# EAGLE design 1605_lora_ES920A (EAGLE 9.5.1)
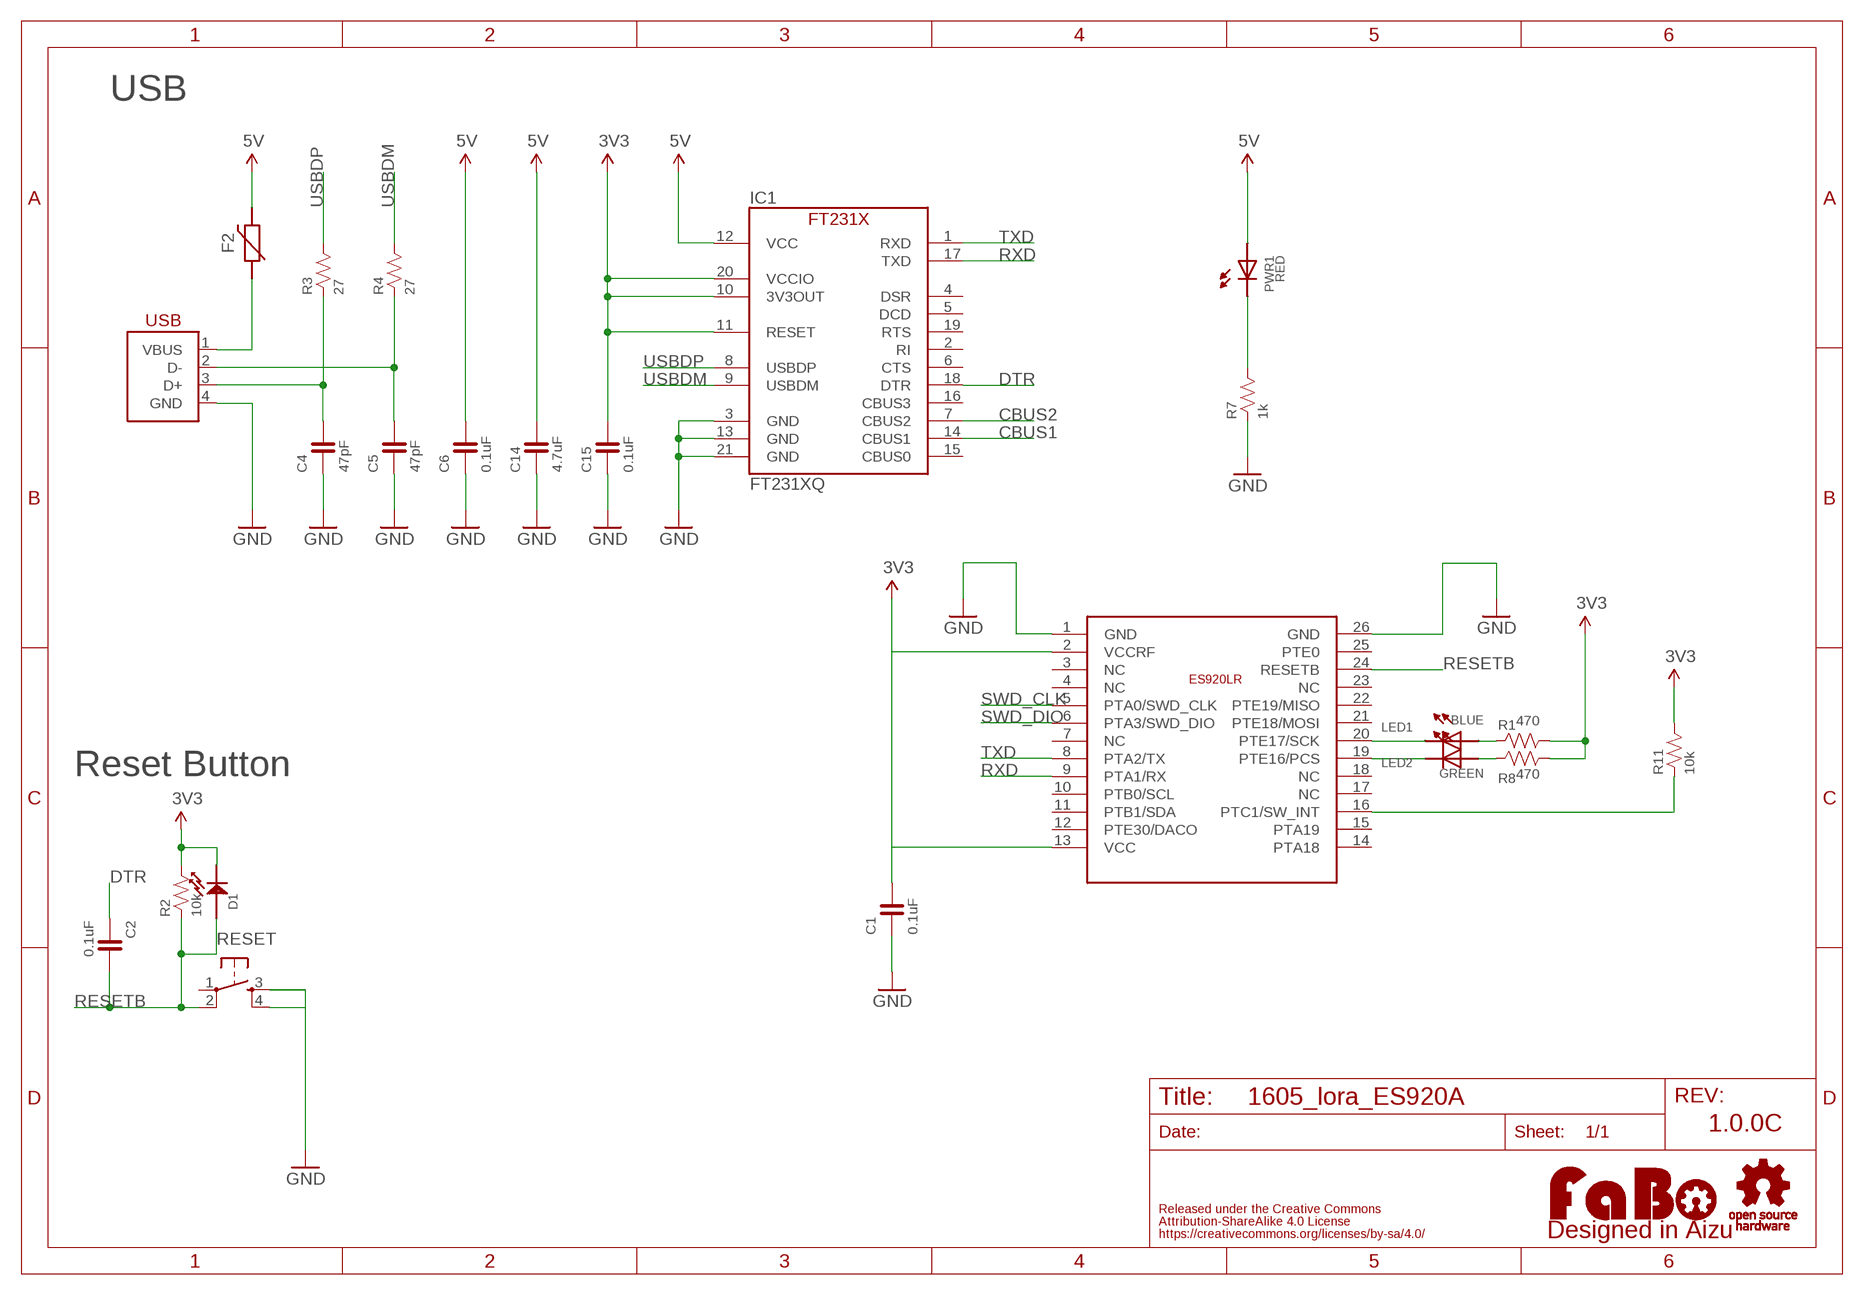
[diagram p0: schematic, sheet 1]

## Parts
C1  0.1uF  CAPACITOR-0603_NARROW  [0603-NARROW]
C2  0.1uF  CAPACITOR-0603_NARROW  [0603-NARROW]
C4  47pF  CAPACITOR-0603_NARROW  [0603-NARROW]
C5  47pF  CAPACITOR-0603_NARROW  [0603-NARROW]
C6  0.1uF  CAPACITOR-0603_NARROW  [0603-NARROW]
C14  4.7uF  CAPACITOR-0603_NARROW  [0603-NARROW]
C15  0.1uF  CAPACITOR-0603_NARROW  [0603-NARROW]
D1  DIODE0603  [0603]
F2  POLYSWITCH  [NANOSMDC035F]
IC1  FT231XQ  [QFN-20_FT231X]
LED1  BLUE  LED-0603  [0603]
LED2  GREEN  LED-0603  [0603]
PWR1  RED  LED-0603-NARROW  [0603-NARROW]
R1  470  RESISTOR-0603-NARROW  [0603-NARROW]
R2  10k  RESISTOR-0603-NARROW  [0603-NARROW]
R3  27  RESISTOR-0603-NARROW  [0603-NARROW]
R4  27  RESISTOR-0603-NARROW  [0603-NARROW]
R7  1k  RESISTOR-0603-NARROW  [0603-NARROW]
R8  470  RESISTOR-0603-NARROW  [0603-NARROW]
R11  10k  RESISTOR-0603-NARROW  [0603-NARROW]
RESET  TACT-SWITCH-SMD_KMR2  [KMR2]
U2  ES920LR_MODULE  [MODULE]
U$2  LOGO_OSHW-M_BOTTOM  [LOGO_OSHW_M_BOTTOM]
U$5  LOGO_FABO-M  [LOGO_FABO_MS]
USB1  USB-B_PTH  [USB-4AF103BS]

## Nets
3V3: C1.2 C15.2 D1.CATHODE IC1.10(3V3OUT) IC1.11(RESET) IC1.20(VCCIO) R1.2 R2.2 R8.2 R11.2 U2.2(VCCRF) U2.13(VCC)
5V: C6.2 C14.2 F2.2 IC1.12(VCC) PWR1.ANODE
CBUS1: IC1.14(CBUS1)
CBUS2: IC1.7(CBUS2)
DTR: C2.1 IC1.18(DTR)
GND: C1.1 C4.1 C5.1 C6.1 C14.1 C15.1 IC1.3(GND) IC1.13(GND) IC1.21(GND) R7.1 RESET.3 RESET.4 U2.1(GND) USB1.4(GND)
N$2: U2.26(GND) ; supply symbol labelled GND
N$3: LED2.CATHODE U2.19(PTE16/PCS)
N$4: LED1.CATHODE U2.20(PTE17/SCK)
N$5: LED1.ANODE R1.1
N$6: LED2.ANODE R8.1
N$7: C5.2 R4.1 USB1.2(D-)
N$8: C4.2 R3.1 USB1.3(D+)
N$11: PWR1.CATHODE R7.2
N$12: R11.1 U2.16(PTC1/SW_INT)
RESETB: C2.2 D1.ANODE R2.1 RESET.2 U2.24(RESETB)
RXD: IC1.17(TXD) U2.9(PTA1/RX)
SWD_CLK: U2.5(PTA0/SWD_CLK)
SWD_DIO: U2.6(PTA3/SWD_DIO)
TXD: IC1.1(RXD) U2.8(PTA2/TX)
USBDM: IC1.9(USBDM) R4.2
USBDP: IC1.8(USBDP) R3.2
VBUS1: F2.1 USB1.1(VBUS)
Unconnected: IC1.2(RI) IC1.4(DSR) IC1.5(DCD) IC1.6(CTS) IC1.15(CBUS0) IC1.16(CBUS3) IC1.19(RTS) RESET.1 U2.3(NC) U2.4(NC) U2.7(NC) U2.10(PTB0/SCL) U2.11(PTB1/SDA) U2.12(PTE30/DACO) U2.14(PTA18) U2.15(PTA19) U2.17(NC) U2.18(NC) U2.21(PTE18/MOSI) U2.22(PTE19/MISO) U2.23(NC) U2.25(PTE0)

## Notes on the sheet
- USB
- Reset Button
- 1.0.0C

## Library data of the parts
C1 C2 C4-C6 C14 C15 = FaBo-Capacitor:CAPACITOR: CAPACITOR
D1 = FaBo-Diode:DIODE
F2 = FaBo-Parts:POLYSWITCH
IC1 = FaBo-USB:FT231X
LED1 LED2 PWR1 = FaBo-LED:LED
R1-R4 R7 R8 R11 = FaBo-Resistors:RESISTOR: RESISTOR
RESET = FaBo-Switch:TACT-SWITCH: Part No Maker Datasheet Distributor 1273HA-160G-G SWITRONIC Catalog <http://www.switronic.com/uploads/images/A10.gif> Akizuki <http://akizukidenshi.com/catalog/g/gP-02561/> DTS-6-V Cosland DTS 6 Series <http://www.cosland.com/newproduct/DTS%20SERIES.pdf> Akizuki <http://akizukidenshi.com/catalog/g/gP-03647/> KMR2 C&K KMR2 SERIES <https://www.ckswitches.com/products/switches/product-details/Tactile/KMR2/> Octoparts Result <https://octopart.com/search?q=KMR2&start=0> TSHA-T-XB2-19E TOP UP INDUSTORY TSHA-T <http://www.top-up.com.tw/front/bin/ptdetail.phtml?Part=TSHA-T> Akizuki <http://akizukidenshi.com/catalog/g/gP-09361/>
U2 = FaBo-LoRa:ES920LR_MODULE
U$2 = FaBo-Logo:LOGO_OSHW
U$5 = FaBo-Logo:LOGO_FABO
USB1 = FaBo-USB:USB: Parts No Maker Datasheet Distributor B05B-PASK-1 JST Datasheet <http://www.jst-mfg.com/product/pdf/eng/ePA-F.pdf> Octoparts Result <https://octopart.com/search?q=B05B-PASK-1> DX4R005JJ2R1800 JAE Datasheet <https://www.jae.com/z-jp/product_jp.cfm?l_code=JA&series_code=DX4&product_number=DX4R005JJ2R1800> Octoparts Result <https://octopart.com/dx4r005jj2r1800-jae+electronics-22232443> S04B-PASK-2 JST Web <http://www.jst-mfg.com/product/detail.php?series=189> Octoparts Result <https://octopart.com/search?q=S04B-PASK-2&start=0> USB-4AF103BS Useconn Electronics Datasheet <http://akizukidenshi.com/download/ds/useconn/USB-4AF103BS-Rev_C.PDF> Akizuki <http://akizukidenshi.com/catalog/g/gC-11551/> USB-A-4P-MALE(1734028-1) TE Web <http://www.te.com/jpn-ja/product-1734028-1.html> Octopart Result <https://octopart.com/1734028-1-te+connectivity-40535237> USB2-AF-WTP-CS-QRFL VPI Datasheet <https://www.vpi.us/dpdf/70/usb2-af-wtp-cs-qrfl.pdf> VPI Store <https://www.vpi.us/usba-waterproof/waterproof-usb-typeb-qrfl-357> ZX62R-B-5P VPI Web <https://www.hirose.com/product/jp/products/ZX/ZX62R-B-5P(30)/> Octopart Result <https://octopart.com/zx62d-b-5p8%2830%29-hirose-70111550>

## Board
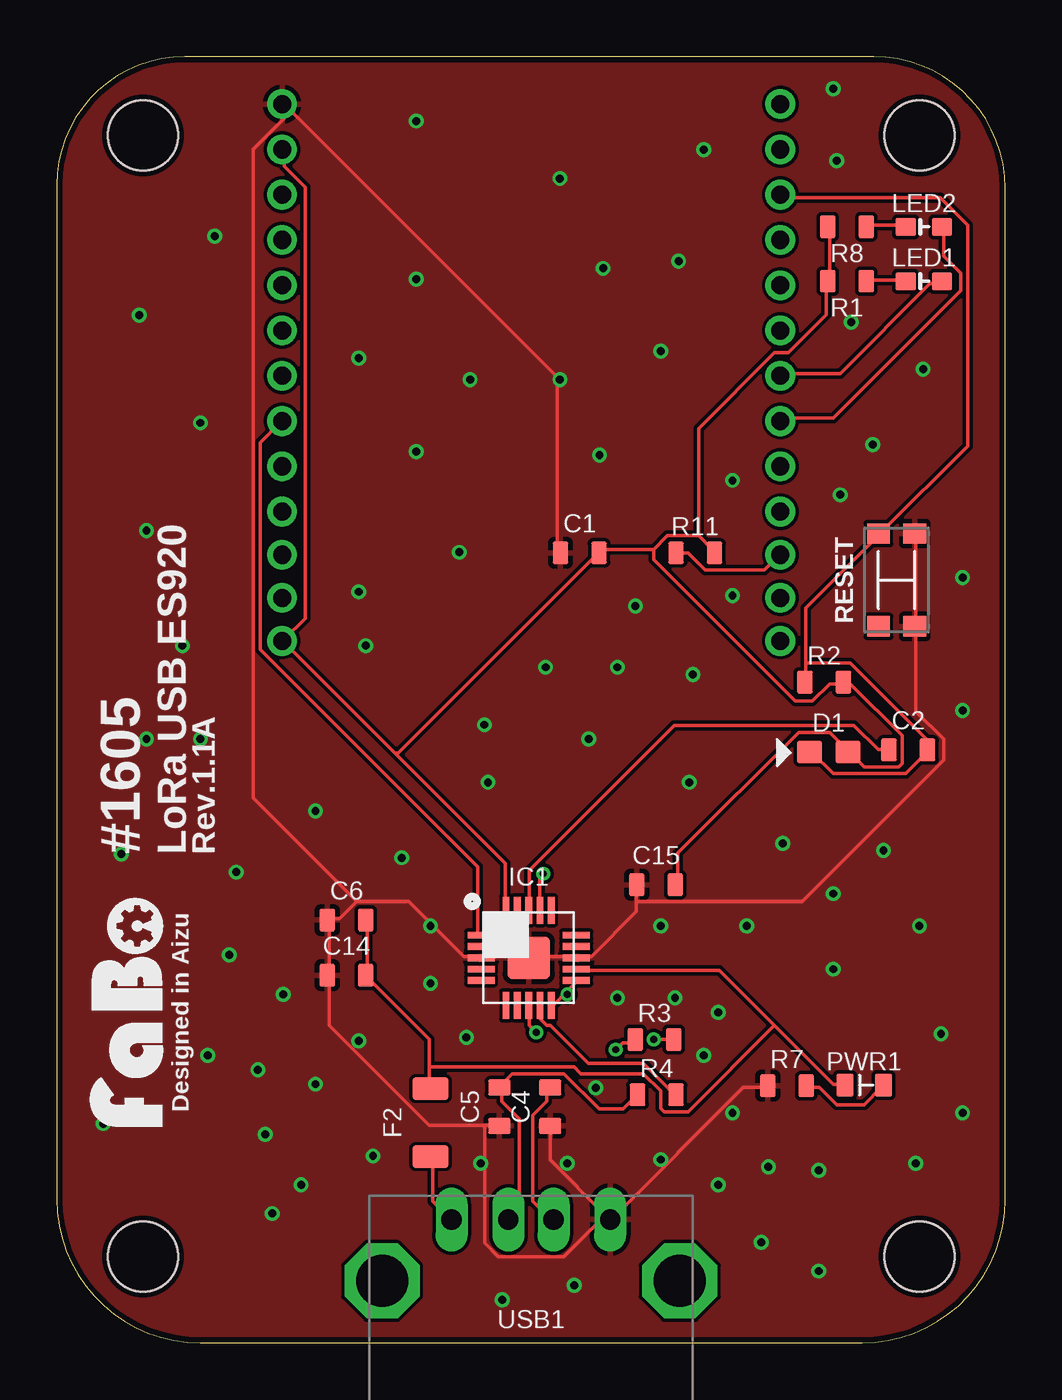
[diagram p1: board, top side]
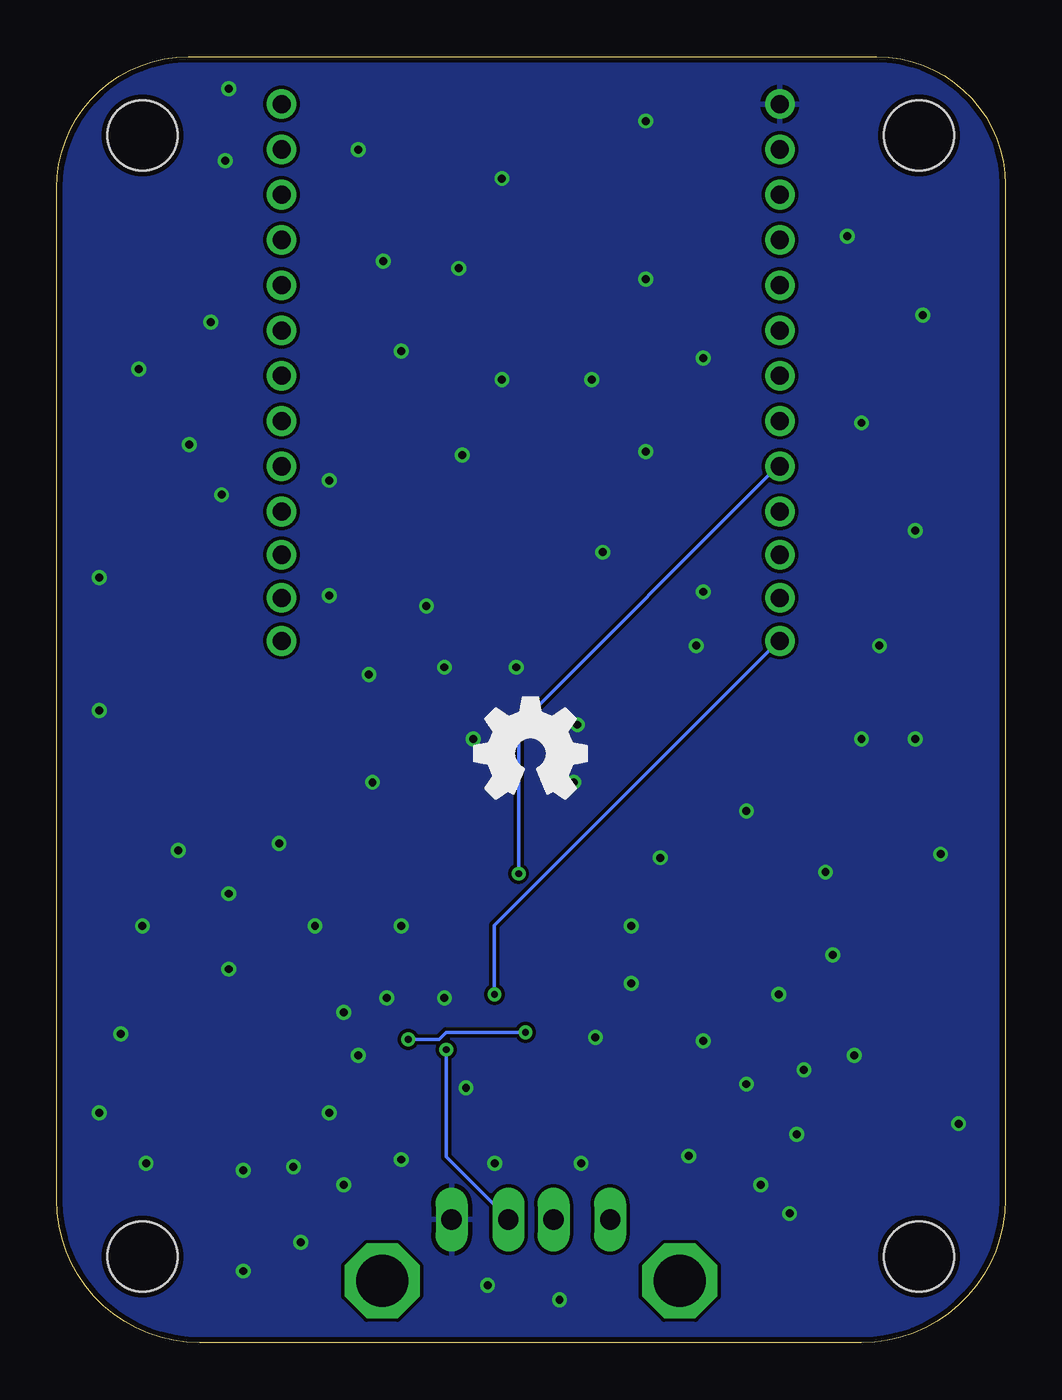
[diagram p2: board, bottom side, seen from below]

Size 41.89 x 56.82 mm. Coordinates in mm from the lower left corner, seen from the top.
Outline: 0,51.16 0,6.35 arc90 6.35,0 35.57,0 arc90 41.89,6.32 41.89,51.01 arc90 36.08,56.82 5.67,56.82 arc90 0,51.16
Copper layers (1*16): Top 0.035mm / dielectric 1.6mm / Bottom 0.035mm
Design rules "PCBway": minimum track width 6mil, minimum drill 12mil, track to track 6mil, track to pad 6mil, pad to pad 6mil, via to via 6mil, smd to smd 6mil, copper to edge 10mil, drill to drill 10mil, minimum pad ring 10mil, minimum via ring 6mil, stop-mask expansion 2mil, vias tented up to drill 100mil, thermal gap 8mil
Holes 3.1 mm at 3.81,53.34 38.1,53.34 38.1,3.81 3.81,3.81

### Footprints (pad centres in the part's own frame; a part is rotated, then mirrored left to right if it is on the bottom)
0603-NARROW = smd 0.71 x 1: 1 -0.85,0; 2 0.85,0
0603 = smd 1.1 x 1: ANODE -0.85,0; CATHODE 0.85,0
NANOSMDC035F = smd 1 x 1.6: 1 -1.5,0; 2 1.5,0
QFN-20_FT231X = smd 1.2 x 0.3: 1 -2.1,1; 2 -2.1,0.5; 3 -2.1,0; 4 -2.1,-0.5; 5 -2.1,-1; 11 2.1,-1; 12 2.1,-0.5; 13 2.1,0; 14 2.1,0.5; 15 2.1,1 | smd 0.3 x 1.2: 6 -1,-2.1; 7 -0.5,-2.1; 8 0,-2.1; 9 0.5,-2.1; 10 1,-2.1; 16 1,2.1; 17 0.5,2.1; 18 0,2.1; 19 -0.5,2.1; 20 -1,2.1 | smd 1.9 x 1.9: 21 0,0
0603' = smd 0.9 x 0.8: ANODE -0.8,0; CATHODE 0.8,0
0603-NARROW' = smd 0.75 x 1: ANODE -0.85,0; CATHODE 0.85,0
KMR2 = smd 0.9 x 1: 1 -2.05,0.8; 2 2.05,0.8; 3 2.05,-0.8; 4 -2.05,-0.8
MODULE = drill 0.8 pad 1.27: 1 -11,9; 2 -11,7; 3 -11,5; 4 -11,3; 5 -11,1; 6 -11,-1; 7 -11,-3; 8 -11,-5; 9 -11,-7; 10 -11,-9; 11 -11,-10.905; 12 -11,-12.81; 13 -11,-14.715; 14 11,-14.715; 15 11,-12.81; 16 11,-10.905; 17 11,-9; 18 11,-7; 19 11,-5; 20 11,-3; 21 11,-1; 22 11,1; 23 11,3; 24 11,5; 25 11,7; 26 11,9
USB-4AF103BS = drill 0.9 long: 1 3.5,0; 2 1,0; 3 -1,0; 4 -3.5,0 | drill 2.3 octagon: P$1 -6.57,2.71; P$2 6.57,2.71

### Placement (x,y rotation side)
C1  23.1,34.9 0 top
C2  37.6,26.2 0 top
C4  21.79,10.43 90 top
C5  19.55,10.43 90 top
C6  12.8,18.68 0 top
C14  12.8,16.24 0 top
C15  26.47,20.24 0 top
D1  34.1,26.1 0 top
F2  16.51,9.73 90 top
IC1  20.84,17.01 0 top
LED1  BLUE  [0603']  38.3,46.9 0 top
LED2  GREEN  [0603']  38.3,49.3 0 top
PWR1  RED  [0603-NARROW']  35.66,11.39 0 top
R1  34.9,46.9 180 top
R2  33.89,29.19 0 top
R3  26.4,13.4 0 top
R4  26.5,10.96 0 top
R7  32.25,11.36 0 top
R8  34.9,49.3 180 top
R11  28.2,34.9 0 top
RESET  37.09,33.7 90 top
U2  20.95,45.72 0 top
U$2  20.95,26.04 0 top
U$5  5.08,14.61 90 top
USB1  20.95,5.45 180 top

### Tracks (layer width: path | path; a pad name or v marks a point on that pad's centre or on a via)
3V3  (via drill 0.3)
  Top 0.152: C15.2 27.43,20.27 27.43,21.64 32.77,26.98 34.14,26.98 34.9,26.21 D1.CATHODE 35.05,26.06 35.66,25.45 37.19,25.45 37.34,25.6 37.34,26.82 35.05,29.11 34.75,29.11 R2.2 34.59,29.11 34.14,29.11 33.38,28.35 32.61,28.35 26.36,34.59 26.36,35.05 | R8.2 34.14,49.23 34.14,46.94 R1.2 33.98,46.79 33.98,45.41 32.31,43.74 31.7,43.74 28.35,40.39 28.35,35.66 | 26.36,35.05 24.08,35.05 C1.2 23.93,34.9 15.09,26.06 14.94,26.06 | 26.36,35.05 26.98,35.66 28.35,35.66 | 28.35,35.66 28.96,35.05 R11.2 | 22.55,15.54 23.01,16 IC1.11 | 22.55,15.54 21.95,14.94 IC1.10 | 14.94,26.06 10.06,30.94 U2.13 10.06,31.09 10.97,32 10.97,51.05 10.06,51.97 10.06,52.58 U2.2 | 14.94,26.06 19.81,21.18 19.81,19.2 IC1.20 | v22.55,15.39 22.55,15.54
  Bottom 0.152: v22.55,15.39 22.55,18.44 10.06,30.94 U2.13
5V
  Top 0.152: C6.2 13.72,18.59 13.72,16.31 C14.2 13.72,16.15 16.46,13.41 16.46,12.19 | 16.46,12.19 16.46,11.28 F2.2 | 31.7,14.02 29.26,16.46 23.01,16.46 IC1.12 | 31.7,14.02 34.29,11.43 34.75,11.43 PWR1.ANODE | 16.46,12.19 22.85,12.19 23.15,11.89 25.9,11.89 26.67,11.12 26.67,10.36 26.82,10.21 27.89,10.21 31.7,14.02
DTR
  Top 0.152: C2.1 36.73,26.21 36.27,26.21 35.2,27.28 27.28,27.28 20.88,20.88 20.88,19.2 IC1.18
GND  (via drill 0.35)
  Top 0.152: 10.36,54.41 10.06,54.71 U2.1 10.36,54.41 | 10.36,54.41 22.1,42.67 22.1,35.05 C1.1 | 24.23,5.64 24.38,5.49 USB1.4 | 24.23,5.64 21.79,8.08 21.79,9.45 C4.1 | R7.1 31.39,11.28 30.33,11.28 24.54,5.49 USB1.4 | 18.9,9.6 16.46,9.6 12.04,14.02 12.04,16.15 C14.1 12.04,16.31 12.04,18.59 C6.1 12.04,18.75 12.5,18.75 13.26,19.51 | 18.9,9.6 19.51,9.6 C5.1 | RESET.3 37.95,35.66 37.95,31.7 RESET.4 37.95,31.55 37.95,27.89 39.17,26.67 39.17,25.76 32.92,19.51 25.6,19.51 | 25.6,19.51 25.6,19.05 23.62,17.07 23.01,17.07 IC1.13 22.86,17.07 20.88,17.07 IC1.21 20.73,17.07 18.75,17.07 IC1.3 18.59,17.07 17.98,17.07 15.54,19.51 13.26,19.51 | 25.6,19.51 25.6,20.12 C15.1 | 24.23,5.64 22.4,3.81 19.51,3.81 18.9,4.42 18.9,9.6 | 24.23,5.64 USB1.4 | 10.36,54.41 8.69,52.73 8.69,24.08 13.26,19.51
  other vias: 24.77,29.84 23.5,26.67 29.84,33.02 27.94,24.77 19.05,24.77 29.21,14.61 30.48,18.41 11.43,11.43 9.53,5.71 19.68,1.91 22.86,2.54 16.51,18.41 22.23,51.44 15.88,46.99 15.88,53.98 22.23,42.55 6.99,48.9 6.35,40.64 6.35,26.67 11.43,23.5 7.62,17.14 8.89,12.06 33.66,7.62 38.1,18.41 15.88,39.37 13.34,13.34 16.51,15.88 13.97,8.26 10.79,6.99 29.21,6.99 33.66,3.17 40.01,10.16 34.29,16.51 26.67,18.41 27.3,15.24 24.77,15.24 28.57,12.7 29.84,10.16 23.81,11.27 18.1,13.49 26.67,8.1 32.07,22.07 13.65,30.8 7.94,20.8 28.57,52.7 27.46,47.78 34.29,55.4 36.04,39.69 40.01,27.94 36.51,21.75 39.05,13.65 3.65,45.4 3.97,35.88 3.97,26.67 6.67,12.7 2.06,9.68 23.97,39.21 17.78,34.92 24.13,47.47 26.67,43.81 25.56,32.54 28.1,29.53 34.29,19.84 31.11,4.45 22.54,7.94 18.73,7.94 15.24,21.43 31.43,7.78 10,15.4 9.21,9.21 13.34,43.5 18.26,42.55 13.34,33.18 21.59,29.84 18.89,27.3 2.86,21.59 5.56,30.8 29.84,38.1 34.61,37.47 38.26,43.02 35.08,45.09 34.45,52.23 40.01,33.81 37.94,7.94
  pour Top: 0,0 0,57.15 41.91,57.15 41.91,0
  pour Bottom: 0,0 0,57.15 41.91,57.15 41.91,0
N$3
  Top 0.152: LED2.CATHODE 39.17,49.23 39.17,48.01 39.93,47.24 39.93,46.48 34.29,40.84 32,40.84 U2.19
N$4
  Top 0.152: LED1.CATHODE 39.01,46.79 38.56,46.79 34.59,42.82 32,42.82 U2.20
N$5
  Top 0.152: LED1.ANODE 37.49,46.94 35.81,46.94 R1.1
N$6
  Top 0.152: LED2.ANODE 37.49,49.38 35.81,49.38 R8.1
N$7
  Top 0.152: USB1.2 19.96,5.49 20.42,5.94 20.42,9.91 19.66,10.67 19.66,11.28 C5.2 19.66,11.43 20.12,11.89 22.4,11.89 23.95,10.34 25.03,10.34 R4.1
N$8  (via drill 0.3)
  Top 0.152: C4.2 21.64,11.28 21.64,10.67 21.03,10.06 21.03,6.25 21.79,5.49 USB1.3 | v24.69,12.95 24.99,13.26 25.45,13.26 R3.1
  Bottom 0.152: v24.69,12.95 24.69,8.23 21.95,5.49 USB1.3
N$11
  Top 0.152: R7.2 33.22,11.28 33.68,11.28 34.44,10.52 35.66,10.52 36.42,11.28 PWR1.CATHODE
N$12
  Top 0.152: R11.1 27.43,34.9 27.89,34.9 28.65,34.14 31.24,34.14 31.85,34.75 U2.16
RESETB
  Top 0.152: D1.ANODE 33.38,26.06 34.29,25.15 37.49,25.15 38.41,26.06 C2.2 38.41,26.21 38.41,26.67 35.05,30.02 33.07,30.02 | 33.07,30.02 33.07,32.46 36.27,35.66 RESET.2 36.42,35.81 40.23,39.62 40.23,49.38 39.01,50.6 32,50.6 U2.24 | 33.07,30.02 33.07,29.26 R2.1
RXD  (via drill 0.3)
  Top 0.152: v21.49,20.73 21.34,20.57 21.34,19.2 IC1.17
  Bottom 0.152: v21.49,20.73 21.49,27.28 10.06,38.71 U2.9
TXD
  Top 0.152: IC1.1 18.59,18.14 18.59,21.03 8.99,30.63 8.99,39.78 9.91,40.69 U2.8
USBDM
  Top 0.152: R4.2 27.28,10.97 25.91,12.34 23.47,12.34 21.79,14.02 21.64,14.02 21.34,14.33 21.34,14.78 IC1.9
USBDP  (via drill 0.3)
  Top 0.152: v26.36,13.41 27.13,13.41 R3.2 | v21.18,13.72 20.88,14.02 20.88,14.78 IC1.8
  Bottom 0.152: v26.36,13.41 24.99,13.41 24.69,13.72 v21.18,13.72
VBUS1
  Top 0.152: F2.1 16.61,8.23 16.61,6.25 17.37,5.49 USB1.1

### Text on the board
tPlace: #1605 | LoRa USB ES920 | Rev.1.1A | Designed in Aizu